# Altium project BurglarAlarm.PrjPcb
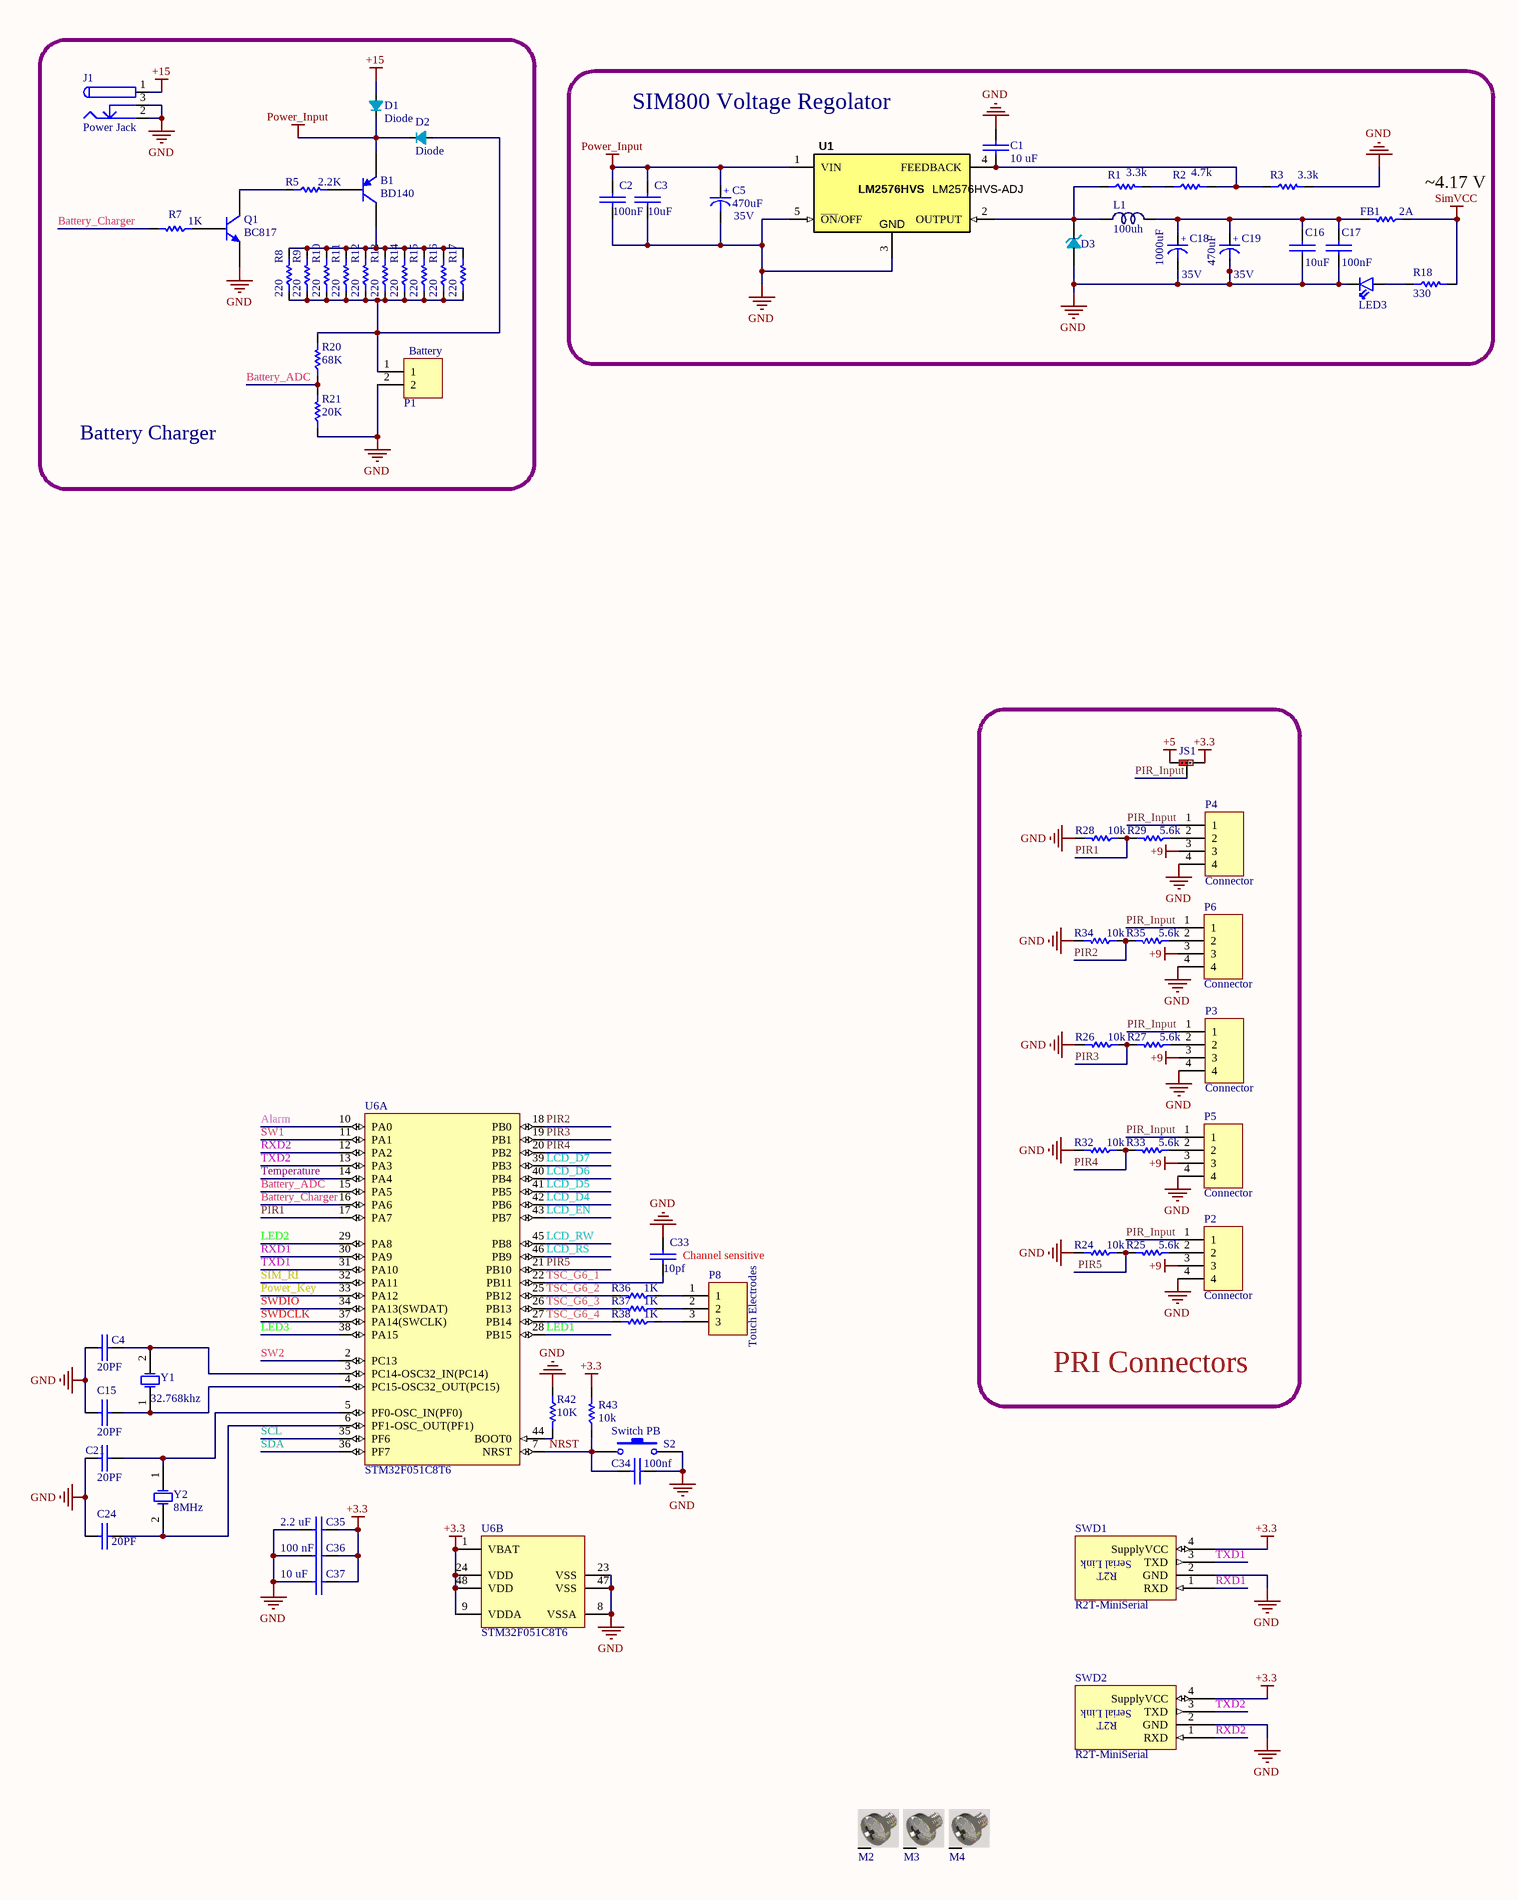
[diagram p0: BurglarAlarm.SchDoc, left]
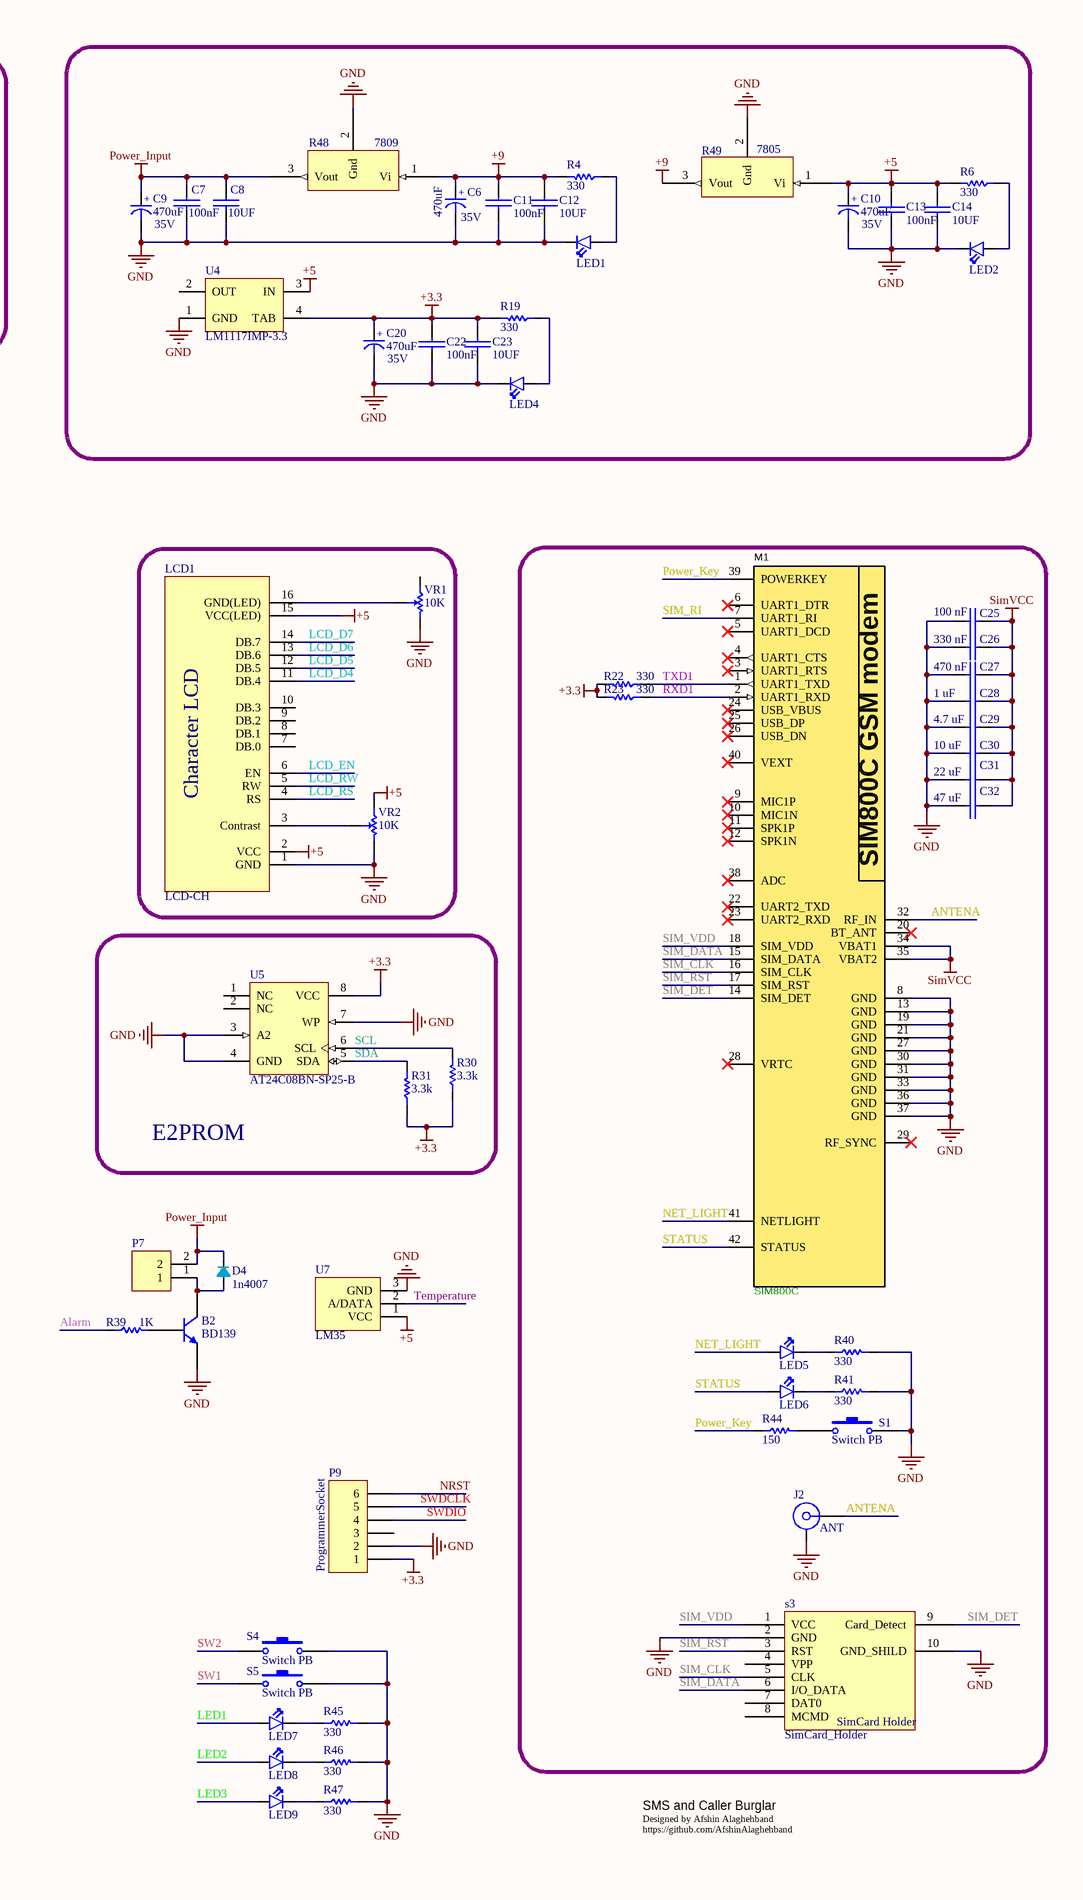
[diagram p1: BurglarAlarm.SchDoc, right]
1 sheet, 137 parts. Net scope: global (net labels, ports and power ports of the same name join across sheets).
Board file: BurglarAlarm.PcbDoc

## Sheet BurglarAlarm.SchDoc
size C

### Parts
B1  BD140  [BD140]
B2  BD139  [BD139]
C1  10 uF  [SMD_CAP_1206]
C2  100nF  [SMD_CAP_1206]
C3  10uF  [SMD_CAP_1206]
C4  20PF  [SMD_CAP_0805]
C5  Voltage: 35V  [cap 03]  (hidden comment: 470uF)
C6  Voltage: 35V  [cap 03]  (hidden comment: 470uF)
C7  100nF  [SMD_CAP_1206]
C8  10UF  [SMD_CAP_1206]
C9  Voltage: 35V  [cap 03]  (hidden comment: 470uF)
C10  Voltage: 35V  [cap 03]  (hidden comment: 470uF)
C11  100nF  [SMD_CAP_1206]
C12  10UF  [SMD_CAP_1206]
C13  100nF  [SMD_CAP_1206]
C14  10UF  [SMD_CAP_1206]
C15  20PF  [SMD_CAP_0805]
C16  10uF  [SMD_CAP_1206]
C17  100nF  [SMD_CAP_1206]
C18  Voltage: 35V  [cap 04]  (hidden comment: 1000uF)
C19  Voltage: 35V  [cap 03]  (hidden comment: 470uF)
C20  Voltage: 35V  [cap 03]  (hidden comment: 470uF)
C21  20PF  [SMD_CAP_0805]
C22  100nF  [SMD_CAP_1206]
C23  10UF  [SMD_CAP_1206]
C24  20PF  [SMD_CAP_0805]
C25  100 nF  [SMD_CAP_1206]
C26  330 nF  [SMD_CAP_1206]
C27  470 nF  [SMD_CAP_1206]
C28  1 uF  [SMD_CAP_1206]
C29  4.7 uF  [SMD_CAP_1206]
C30  10 uF  [SMD_CAP_1206]
C31  22 uF  [SMD_CAP_1206]
C32  47 uF  [SMD_CAP_1206]
C33  10pf  [SMD_CAP_0805]
C34  100nf  [SMD_CAP_0805]
C35  2.2 uF  [SMD_CAP_0805]
C36  100 nF  [SMD_CAP_0805]
C37  10 uF  [SMD_CAP_0805]
D1  Description:: Diode  [DO-214AC ( SMD Diode )]  (hidden comment: 1N4007)
D2  Description:: Diode  [DO-214AC ( SMD Diode )]  (hidden comment: 1N4007)
D3  SS34  [DIOMELF3615N]  (value not drawn)
D4  1N4007  [DO-214AC ( SMD Diode )]
FB1  2A  [SMD_RES_1206]
J1  Power Jack  [Power Jack]
J2  ANT  [ROS-32K101-400L5_V]
JS1  JumperSMD 3Pin  [JumperSMD 3Pin - UltraSmall]  (value not drawn)
L1  100uh  [General 10x12(200m) Inductor]
LCD1  LCD-CH  [LCD2-16]
LED1  LED  [LED0805]  (value not drawn)
LED2  LED  [LED0805]  (value not drawn)
LED3  LED  [LED0805]  (value not drawn)
LED4  LED  [LED0805]  (value not drawn)
LED5  LED  [LED0805]  (value not drawn)
LED6  LED  [LED0805]  (value not drawn)
LED7  LED  [LED0805]  (value not drawn)
LED8  LED  [LED0805]  (value not drawn)
LED9  LED  [LED0805]  (value not drawn)
M1  SIM800C  [Sim800c]
M2  Screw  [Board Screw]  (value not drawn)
M3  Screw  [Board Screw]  (value not drawn)
M4  Screw  [Board Screw]  (value not drawn)
P1  Battery  [Terminal Block 2pin]
P2  Connector  [PH 4A Connector]
P3  Connector  [PH 4A Connector]
P4  Connector  [PH 4A Connector]
P5  Connector  [PH 4A Connector]
P6  Connector  [PH 4A Connector]
P7  Connector  [Polarized Header 2]  (value not drawn)
P8  Touch Electrodes  [PH Connector 3Pin]
P9  ProgrammerSocket  [HDR1X6]
Q1  BC817  [SOT23_BEC_N]
R1  3.3k  [RES 0805 (2012X06L)]
R2  4.7k  [RES 0805 (2012X06L)]
R3  3.3k  [RES 0805 (2012X06L)]
R4  330  [RES 0805 (2012X06L)]
R5  2.2K  [RES 0805 (2012X06L)]
R6  330  [RES 0805 (2012X06L)]
R7  1K  [RES 0805 (2012X06L)]
R8  220  [RES 1206 (3216X08L)]
R9  220  [RES 1206 (3216X08L)]
R10  220  [RES 1206 (3216X08L)]
R11  220  [RES 1206 (3216X08L)]
R12  220  [RES 1206 (3216X08L)]
R13  220  [RES 1206 (3216X08L)]
R14  220  [RES 1206 (3216X08L)]
R15  220  [RES 1206 (3216X08L)]
R16  220  [RES 1206 (3216X08L)]
R17  220  [RES 1206 (3216X08L)]
R18  330  [RES 0805 (2012X06L)]
R19  330  [RES 0805 (2012X06L)]
R20  68K  [RES 0805 (2012X06L)]
R21  20K  [RES 0805 (2012X06L)]
R22  330  [RES 0805 (2012X06L)]
R23  330  [RES 0805 (2012X06L)]
R24  10k  [RES 0805 (2012X06L)]
R25  5.6k  [RES 0805 (2012X06L)]
R26  10k  [RES 0805 (2012X06L)]
R27  5.6k  [RES 0805 (2012X06L)]
R28  10k  [RES 0805 (2012X06L)]
R29  5.6k  [RES 0805 (2012X06L)]
R30  3.3k  [RES 0805 (2012X06L)]
R31  3.3k  [RES 0805 (2012X06L)]
R32  10k  [RES 0805 (2012X06L)]
R33  5.6k  [RES 0805 (2012X06L)]
R34  10k  [RES 0805 (2012X06L)]
R35  5.6k  [RES 0805 (2012X06L)]
R36  1K  [RES 0805 (2012X06L)]
R37  1K  [RES 0805 (2012X06L)]
R38  1K  [RES 0805 (2012X06L)]
R39  1K  [RES 0805 (2012X06L)]
R40  330  [RES 0805 (2012X06L)]
R41  330  [RES 0805 (2012X06L)]
R42  10K  [RES 0805 (2012X06L)]
R43  10k  [RES 0805 (2012X06L)]
R44  150  [RES 0805 (2012X06L)]
R45  330  [RES 0805 (2012X06L)]
R46  330  [RES 0805 (2012X06L)]
R47  330  [RES 0805 (2012X06L)]
R48  L7809  [To-220]  (value not drawn)
R49  L7805  [To-220]  (value not drawn)
S1  Switch PB  [SW-PB]
S2  Switch PB  [SW-PB]
s3  SimCard_Holder  [Standard_Sim]
S4  Switch PB  [SW-PB]
S5  Switch PB  [SW-PB]
SWD1  R2T-MiniSerial  [SerialWireMini]
SWD2  R2T-MiniSerial  [SerialWireMini]
U1  LM2576HVS-ADJ  [TO-263-5]
U4  LM1117IMP-3.3  [MP04A_N]
U5  AT24C08BN-SP25-B  [8S1_N]
U6  STM32F051C8T6  [STM-LQFP48_N]  (parts A,B of 2)
U7  LM35  [LM35]
VR1  10K  [Pot 00]
VR2  10K  [Pot 00]
Y1  32.768khz  [XTAL RTC]
Y2  8MHz  [XTAL Small]

### Blocks framed on the sheet
Battery Charger: B1 D1 D2 J1 P1 Q1 R5 R7-R17 R20 R21
SIM800 Voltage Regolator: C1-C3 C5 C16-C19 D3 FB1 L1 LED3 R1-R3 R18 U1
PRI Connectors: JS1 P2-P6 R24-R29 R32-R35
E2PROM: R30 R31 U5

### Nets
+3.3: C20.1(+) C22.1(+) C23.1(+) C35.2(-) C36.2(-) C37.2(-) JS1.1 P9.1 R19.2 R22.2 R23.2 R30.1 R31.1 R43.2 SWD1.4(SupplyVCC) SWD2.4(SupplyVCC) U4.4(TAB) U5.8(VCC) U6.1(VBAT) U6.9(VDDA) U6.24(VDD) U6.48(VDD)
+5: C10.1(+) C13.1(+) C14.1(+) JS1.3 LCD1.2(VCC) LCD1.15(VCC(LED)) R6.2 R49.1(Vi) U4.3(IN) U7.1(VCC) VR2.1(CCW)
+9: C6.1(+) C11.1(+) C12.1(+) P2.3 P3.3 P4.3 P5.3 P6.3 R4.2 R48.1(Vi) R49.3(Vout)
+15: D1.0 J1.1
GND: B2.E C1.1(+) C2.2(-) C3.2(-) C4.2(-) C5.2(-) C6.2(-) C7.2(-) C8.2(-) C9.2(-) C10.2(-) C11.2(-) C12.2(-) C13.2(-) C14.2(-) C15.2(-) C16.2(-) C17.2(-) C18.2(-) C19.2(-) C20.2(-) C21.1(+) C22.2(-) C23.2(-) C24.1(+) C25.1(+) C26.1(+) C27.1(+) C28.1(+) C29.1(+) C30.1(+) C31.1(+) C32.1(+) C33.1(+) C34.1(+) C35.1(+) C36.1(+) C37.1(+) D3.2 J1.2 J1.3 J2.MH LCD1.1(GND) LED1.2(K) LED2.2(K) LED3.2(K) LED4.2(K) M1.8(GND) M1.13(GND) M1.19(GND) M1.21(GND) M1.27(GND) M1.30(GND) M1.31(GND) M1.33(GND) M1.36(GND) M1.37(GND) P1.2 P2.4 P3.4 P4.4 P5.4 P6.4 P9.2 Q1.2(E) R3.2 R21.1 R24.2 R26.2 R28.2 R32.2 R34.2 R40.2 R41.2 R42.1 R45.2 R46.2 R47.2 R48.2(Gnd) R49.2(Gnd) S1.2 S2.2 s3.2(GND) s3.10(GND_SHILD) S4.2 S5.2 SWD1.2(GND) SWD2.2(GND) U1.3(GND) U1.5(~{ON}/OFF) U4.1(GND) U5.3(A2) U5.4(GND) U5.7(WP) U6.8(VSSA) U6.23(VSS) U6.47(VSS) U7.3(GND) VR1.2(CW) VR2.2(CW)
Power_Input: B1.C C2.1(+) C3.1(+) C5.1(+) C7.1(+) C8.1(+) C9.1(+) D1.1 D2.1 D4.1 P7.2 R48.3(Vout) U1.1(VIN)
SimVCC: C25.2(-) C26.2(-) C27.2(-) C28.2(-) C29.2(-) C30.2(-) C31.2(-) C32.2(-) FB1.1 M1.34(VBAT1) M1.35(VBAT2) R18.2
Alarm: R39.1 U6.10(PA0)
ANTENA: J2.1 M1.32(RF_IN)
Battery_ADC: R20.1 R21.2 U6.15(PA5)
Battery_Charger: R7.2 U6.16(PA6)
LCD_D4: LCD1.11(DB.4) U6.42(PB6)
LCD_D5: LCD1.12(DB.5) U6.41(PB5)
LCD_D6: LCD1.13(DB.6) U6.40(PB4)
LCD_D7: LCD1.14(DB.7) U6.39(PB3)
LCD_EN: LCD1.6(EN) U6.43(PB7)
LCD_RS: LCD1.4(RS) U6.46(PB9)
LCD_RW: LCD1.5(RW) U6.45(PB8)
LED1: LED7.1(A) U6.28(PB15)
LED2: LED8.1(A) U6.29(PA8)
LED3: LED9.1(A) U6.38(PA15)
NET_LIGHT: LED5.1(A) M1.41(NETLIGHT)
NRST: C34.2(-) P9.6 R43.1 S2.1 U6.7(NRST)
PIR1: R28.1 R29.2 U6.17(PA7)
PIR2: R34.1 R35.2 U6.18(PB0)
PIR3: R26.1 R27.2 U6.19(PB1)
PIR4: R32.1 R33.2 U6.20(PB2)
PIR5: R24.1 R25.2 U6.21(PB10)
PIR_Input: JS1.2 P2.1 P3.1 P4.1 P5.1 P6.1
Power_Key: M1.39(POWERKEY) R44.1 U6.33(PA12)
RXD1: M1.2(UART1_RXD) R23.1 SWD1.1(RXD) U6.30(PA9)
RXD2: SWD2.1(RXD) U6.12(PA2)
SCL: R30.2 U5.6(SCL) U6.35(PF6)
SDA: R31.2 U5.5(SDA) U6.36(PF7)
SIM_CLK: M1.16(SIM_CLK) s3.5(CLK)
SIM_DATA: M1.15(SIM_DATA) s3.6(I/O_DATA)
SIM_DET: M1.14(SIM_DET) s3.9(Card_Detect)
SIM_RI: M1.7(UART1_RI) U6.32(PA11)
SIM_RST: M1.17(SIM_RST) s3.3(RST)
SIM_VDD: M1.18(SIM_VDD) s3.1(VCC)
STATUS: LED6.1(A) M1.42(STATUS)
SW1: S5.1 U6.11(PA1)
SW2: S4.1 U6.2(PC13)
SWDCLK: P9.5 U6.37(PA14(SWCLK))
SWDIO: P9.4 U6.34(PA13(SWDAT))
Temperature: U6.14(PA4) U7.2(A/DATA)
TSC_G6_1: C33.2(-) U6.22(PB11)
TSC_G6_2: R36.2 U6.25(PB12)
TSC_G6_3: R37.2 U6.26(PB13)
TSC_G6_4: R38.2 U6.27(PB14)
TXD1: M1.1(UART1_TXD) R22.1 SWD1.3(TXD) U6.31(PA10)
TXD2: SWD2.3(TXD) U6.13(PA3)
NetB1_B: B1.B R5.2
NetB1_E: B1.E R8.2 R9.2 R10.2 R11.2 R12.2 R13.2 R14.2 R15.2 R16.2 R17.2
NetB2_B: B2.B R39.2
NetB2_C: B2.C D4.0 P7.1
NetC1_2: C1.2(-) R2.2 R3.1 U1.4(FEEDBACK)
NetC4_1: C4.1(+) U6.3(PC14-OSC32_IN(PC14)) Y1.2(OSC2)
NetC15_1: C15.1(+) U6.4(PC15-OSC32_OUT(PC15)) Y1.1(OSC1)
NetC16_1: C16.1(+) C17.1(+) C18.1(+) C19.1(+) FB1.2 L1.2
NetC21_2: C21.2(-) U6.5(PF0-OSC_IN(PF0)) Y2.1(OSC1)
NetC24_2: C24.2(-) U6.6(PF1-OSC_OUT(PF1)) Y2.2(OSC2)
NetD2_0: D2.0 P1.1 R8.1 R9.1 R10.1 R11.1 R12.1 R13.1 R14.1 R15.1 R16.1 R17.1 R20.2
NetD3_1: D3.1 L1.1 R1.1 U1.2(OUTPUT)
NetLCD1_3: LCD1.3(Contrast) VR2.3(Setpoint)
NetLCD1_16: LCD1.16(GND(LED)) VR1.3(Setpoint)
NetLED1_1: LED1.1(A) R4.1
NetLED2_1: LED2.1(A) R6.1
NetLED3_1: LED3.1(A) R18.1
NetLED4_1: LED4.1(A) R19.1
NetLED5_2: LED5.2(K) R40.1
NetLED6_2: LED6.2(K) R41.1
NetLED7_2: LED7.2(K) R45.1
NetLED8_2: LED8.2(K) R46.1
NetLED9_2: LED9.2(K) R47.1
NetP2_2: P2.2 R25.1
NetP3_2: P3.2 R27.1
NetP4_2: P4.2 R29.1
NetP5_2: P5.2 R33.1
NetP6_2: P6.2 R35.1
NetP8_1: P8.1 R36.1
NetP8_2: P8.2 R37.1
NetP8_3: P8.3 R38.1
NetQ1_1: Q1.1(B) R7.1
NetQ1_3: Q1.3(C) R5.1
NetR1_2: R1.2 R2.1
NetR42_2: R42.2 U6.44(BOOT0)
NetR44_2: R44.2 S1.1

Not connected (* = marked no-connect by the designer): LCD1 7(DB.0) 8(DB.1) 9(DB.2) 10(DB.3); M1 3(UART1_RTS)* 4(UART1_CTS)* 5(UART1_DCD)* 6(UART1_DTR)* 9(MIC1P)* 10(MIC1N)* 11(SPK1P)* 12(SPK1N)* 20(BT_ANT)* 22(UART2_TXD)* 23(UART2_RXD)* 24(USB_VBUS)* 25(USB_DP)* 26(USB_DN)* 28(VRTC)* 29(RF_SYNC)* 38(ADC)* 40(VEXT)*; M2 S; M3 S; M4 S; P9 3; s3 4(VPP) 7(DAT0) 8(MCMD); U4 2(OUT); U5 1(NC) 2(NC); VR1 1(CCW)

### Notes on the sheet
- (near FB1) ~4.17 V
- Channel sensitive
- Designed by Afshin Alaghehband https://github.com/AfshinAlaghehband
- SMS and Caller Burglar Alaram using PIR
- (in symbol L78XX) 7809; 7805
- (in symbol LCD-CH) Character LCD
- (in symbol R2T-MiniSerial) Serial Link; R2T
- (in symbol SIM800C) SIM800C GSM modem
- (in symbol SimCard_Holder) SimCard Holder

### Library data of the parts
B1 = BD140: PNP BJT
B2 = BD139: BJT
C1-C4 C7 C8 C11-C17 C21-C37 = Cap-Bipolar: Bipolar Capacitor; Voltage: 100V; Designer: Saeid Jorablo; Organazation: ControTec; Adding Date: 1387/12/20
  C1 C30 C37: Value: 10 uF
  C2 C7 C11 C13 C17 C22: Value: 100nF
  C3 C16: Value: 10uF
  C4 C15 C21 C24: Value: 20PF
  C8 C12 C14 C23: Value: 10UF
  C25 C36: Value: 100 nF
  C26: Value: 330 nF
  C27: Value: 470 nF
  C28: Value: 1 uF
  C29: Value: 4.7 uF
  C31: Value: 22 uF
  C32: Value: 47 uF
  C33: Value: 10pf
  C34: Value: 100nf
  C35: Value: 2.2 uF
C5 C6 C9 C10 C18-C20 = Cap-Polar: Polar Capacitor; Designer: Saeid Jorablo; Organazation: ControTec; Adding Date: 1387/12/20
  C5 C6 C9 C10 C19 C20: Value: 470uF
  C18: Value: 1000uF
D1 D2 = SMD Diodes: SMD Diode; Designer :: Hamed Jafarzadeh
D3 = Diode Zener SMD: Fast or shotky Diode; Designer: Hamed Jafarzadeh
D4 = SMD Diodes: Designer :: Hamed Jafarzadeh; Description:: 1n4007
FB1 R4-R47 = Resistor: Tolerance: 5%; Power: 1/8 W
  FB1: Value: 2A
  R4 R6 R18 R19 R22 R23 R40 R41 R45-R47: Value: 330
  R5: Value: 2.2K
  R7 R36-R39: Value: 1K
  R8-R17: Value: 220
  R20: Value: 68K
  R21: Value: 20K
  R24 R26 R28 R32 R34 R43: Value: 10k
  R25 R27 R29 R33 R35: Value: 5.6k
  R30 R31: Value: 3.3k
  R42: Value: 10K
  R44: Value: 150
J1 = Power Jack: 15V DC 1A Adaptor; Designer: Saeid Jorablo; Company: Personal; Project Name: Laser; Adding Date: 10/21/2009
J2 = 32K101-400L5: SMA Straight Jack, Up to 18 GHz; Design Note: Footprint in library is a generic example - only application specific footprint delivers High Performance; DatasheetVersion: a00; PackageVersion: a00; PackageReference: 32K101-400L5; PackageDescription: SMA Straight Jack, 6.35 x 6.35 x 9.5 mm; Mounting Technology: Through Hole; PartNumber: 32K101-400L5; ComponentLink1Description: Manufacturer URL; ComponentLink1URL: http://www.rosenberger.de; ComponentLink2Description: Datasheet; ComponentLink2URL: http://rosenberger.de/ok/images/documents/db/32K101-400L5.pdf; ComponentLink3Description: Package Specification; ComponentLink3URL: http://rosenberger.de/ok/images/documents/db/32K101-400L5.pdf; ComponentLink4Description: Series Overview / Design Note; ComponentLink4URL: http://rosenberger.de/ok/images/documents/spez/32.pdf; ComponentLink5Description: Webshop / RFQ; ComponentLink5URL: http://www.rosenberger.com/en/contact/sales/
L1 = Inductor: Designer:: Hamed Jafarzadeh - hjafarzadeh511@gmail.com
LCD1 = LCD-CH: LCD 16*2
LED1-LED9 = LED: Designer :: Razi Research Team Of Mashhad - Hamed Jafarzadeh
M1 = SIM800C: Sim800c GSM modem
M2-M4 = Board Screw: Board Screw With Spacer
P1 = Connector 2Pin: 12V Lead acid battery; Designer:: Hamed Jafarzadeh - www.R2T.ir
P2-P6 = Connector 4Pin: PIR connector; Designer:: Hamed Jafarzadeh - www.R2T.ir
P7 = Connector 2Pin: 12V Alarm connector (power input voltage dropped by a transistor); Designer:: Hamed Jafarzadeh - www.R2T.ir
P8 = Connector 3Pin: 3 pin PH connector; Designer:: Hamed Jafarzadeh - www.R2T.ir
P9 = Header 6: programming socket; LatestRevisionDate: 17-Jul-2002; LatestRevisionNote: Re-released for DXP Platform.; Publisher: Altium Limited
Q1 = NPN: NPN Bipolar Transistor; Published: 8-Jun-2000; LatestRevisionDate: 29-May-2009; LatestRevisionNote: IPC-7351 Footprint Added.; PackageVersion: Aug-1999; PackageReference: SOT-23B; Publisher: Altium Limited; PackageDescription: 3-Pin SOT-23 Package 0.95 mm Pitch, 2.4 mm Lead Span
R1-R3 = Resistor
  R1 R3: Value: 3.3k
  R2: Value: 4.7k
R48 = L78XX: 7809 deep 9V Linear Regulator
R49 = L78XX: 7805 deep 5V Linear Regulator
S1 S2 S4 S5 = Switch PB: Push Button Switch
s3 = SimCard_Holder: Sim Holder
SWD1 SWD2 = R2T-MiniSerial: USART connector
U1 = LM2576HVS: Switching Voltage Regulator, SMD, LM2576HVS-Adjustable; Manufacturer 1: National Semiconductor; Voltage Regulator Type: Switching Buck; Tolerance: ±4%; Ratings: 60Vin Max; 150kHz; Value: 5V; 1A; SCDType: source; Package / Case: TO-263-5; Supplier 1: Digi-Key; Supplier Part Number 1: LM2591HVS-5.0-ND; Manufacturer Part Number 1: LM2576HVS
U4 = LM1117IMP-x.x: 3.3 Volt, 800mA Linear Regulator; Manufacturer: National Semiconductor; PackageTopMarking: XYTT*N05B; PowerWise: N; CompType: LDO IC; Published: 4-Dec-2008; DatasheetVersion: Apr-2006; PackageVersion: revB, Apr-2003; PackageReference: MP04A; Publisher: Altium Limited; PackageDescription: Molded SOT-223, 6.50 x 3.56 x 1.6mm Body, 4 Lead, 2.3mm Pitch; Supplier 1: Farnell; Supplier Part Number 1: 7614123; PartNumber: LM1117IMP-3.3; RoHS: N; PinCount: 4; Code_JEDEC: TO-261-AA; Code_IPC: SOT223-4; ComponentLink1Description: LM1117 Datasheet; ComponentLink1URL: http://www.national.com/ds/LM/LM1117.pdf; ComponentLink2Description: LM1117 Web Page; ComponentLink2URL: http://www.national.com/pf/LM/LM1117.html; ComponentLink3Description: MP04A Package Page; ComponentLink3URL: http://www.national.com/packaging/folders/mp04a.html
U5 = AT24C08BN-SP25-B: 8Kbit EEPROM; DatasheetVersion: 8517C,  Jan-2009; PackageVersion: revC, Mar-2005; PackageReference: 8S1; PackageDescription: 8-Lead (0.150" Wide Body), Plastic Gull Wing Small Outline (JEDEC SOIC); Code_JEDEC: MS-012-AA; Code_IPC: SOIC127P600-8; ComponentLink1Description: Manufacturer URL; ComponentLink1URL: http://www.atmel.com/; ComponentLink2Description: Datasheet; ComponentLink2URL: http://www.atmel.com/dyn/resources/prod_documents/doc8517.pdf
U6 = STM32F051C8T6: ARM Cortex-M0 32-bit, 48-pin LQFP; FLASH Size (Prog) (kB): 64; I/Os (High Current): 39; Internal RAM Size (kB): 8; Operating Frequency(F) (Processor speed) (MHz): 48; Packing: Tray; Supply Voltage(Vcc) min (V): 2; DatasheetVersion: Rev. 3; PackageVersion: Rev. 6, 06/2013; PackageReference: LQFP48; PackageDescription: 48-Pin Low Profile Quad Flat Package, 7 x 7 mm Body, 0.5 mm Pitch; Supplier 1: Digi-Key; Supplier Part Number 1: 497-12893-ND; Supplier 2: Farnell; Supplier Part Number 2: 2115065; Supplier 3: Newark; Supplier Part Number 3: 05W5802; Supplier 4: Newark; Supplier Part Number 4: 90T0636; Supplier 5: Mouser; Supplier Part Number 5: 511-STM32F051C8T6; Core: ARM Cortex-M0; Mounting Technology: Surface Mount; PartNumber: STM32F051C8T6; ComponentLink1Description: Manufacturer URL; ComponentLink1URL: http://www.st.com/web/en/home.html; ComponentLink2Description: Datasheet; ComponentLink2URL: http://www.st.com/st-web-ui/static/active/en/resource/technical/document/datasheet/DM00039193.pdf; ComponentLink3Description: Package Specification; ComponentLink3URL: http://www.st.com/st-web-ui/static/active/en/resource/technical/document/datasheet/DM00058181.pdf
U7 = LM35: Temperature sensor
VR1 VR2 = Resistor Variable: Variable Resistor; Designer: Saeid Jorablo; Company: ControTec; Adding Date: 137/12/22; Value: 10K
Y1 = XTAL: Company: E.P.I.L; Design Date: 11/04/2011; Value: 32.768khz
Y2 = XTAL: 8 MHz; Company: E.P.I.L; Design Date: 11/04/2011; Value: 8MHz